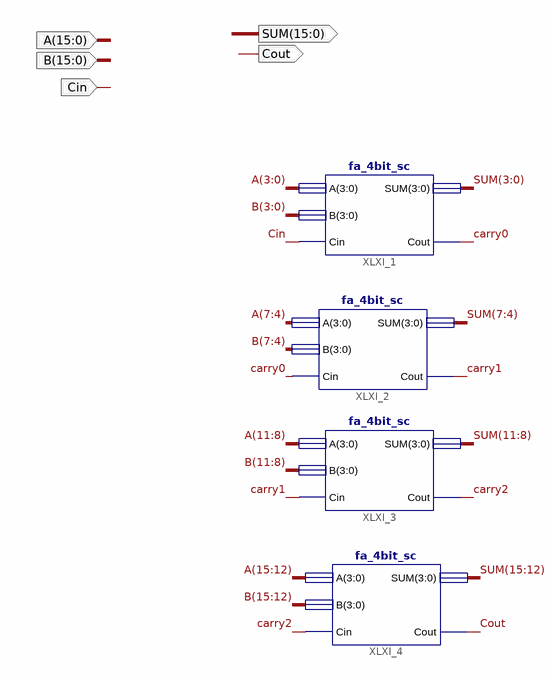
[diagram p0: schematic sheet 1]
// Xilinx ISE schematic fa16bit_sc.sch (spartan6) as structural Verilog: 4 symbols, 5 ports
module fa16bit_sc (
  input  [15:0] A,
  input  [15:0] B,
  input  Cin,
  output [15:0] SUM,
  output Cout
);

  wire carry0, carry1, carry2;

  fa_4bit_sc XLXI_1 (.A(A[3:0]), .B(B[3:0]), .Cin(Cin), .SUM(SUM[3:0]), .Cout(carry0));
  fa_4bit_sc XLXI_2 (.A(A[7:4]), .B(B[7:4]), .Cin(carry0), .SUM(SUM[7:4]), .Cout(carry1));
  fa_4bit_sc XLXI_3 (.A(A[11:8]), .B(B[11:8]), .Cin(carry1), .SUM(SUM[11:8]), .Cout(carry2));
  fa_4bit_sc XLXI_4 (.A(A[15:12]), .B(B[15:12]), .Cin(carry2), .SUM(SUM[15:12]), .Cout(Cout));
endmodule
